# Altium schematic sheet QCopterMV_SD_Sch.SchDoc
size A4
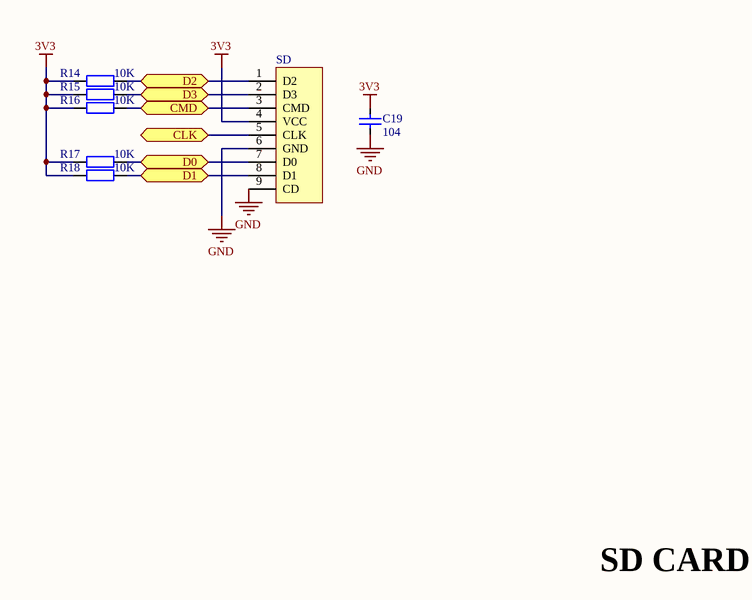
[diagram p0: QCopterMV_SD_Sch.SchDoc]

## Parts
C19  value 104  [CAP_0603]  (hidden comment: Cap_0603)
R14  value 10K  [RES_0603]  (hidden comment: Res_0603)
R15  value 10K  [RES_0603]  (hidden comment: Res_0603)
R16  value 10K  [RES_0603]  (hidden comment: Res_0603)
R17  value 10K  [RES_0603]  (hidden comment: Res_0603)
R18  value 10K  [RES_0603]  (hidden comment: Res_0603)
SD  SD_Card_TF  [SD_Card_TF]  (value not drawn)

## Ports
CLK, CMD, D0, D1, D2, D3

## Nets
3V3: C19.2 R14.1 R15.1 R16.1 R17.1 R18.1 SD.4(VCC)
GND: C19.1 SD.6(GND) SD.9(CD)
CLK: SD.5(CLK) ; port CLK
CMD: R16.2 SD.3(CMD) ; port CMD
D0: R17.2 SD.7(D0) ; port D0
D1: R18.2 SD.8(D1) ; port D1
D2: R14.2 SD.1(D2) ; port D2
D3: R15.2 SD.2(D3) ; port D3

## Notes on the sheet
- Labels drawn without touching a wire or pin: SD CARD

## Library data of the parts
C19 = Cap_0603: Capacitor
R14-R18 = Res_0603: Resistor
SD = SD_Card_TF: SD